# EAGLE design Schematic1 (EAGLE 7.4.0)
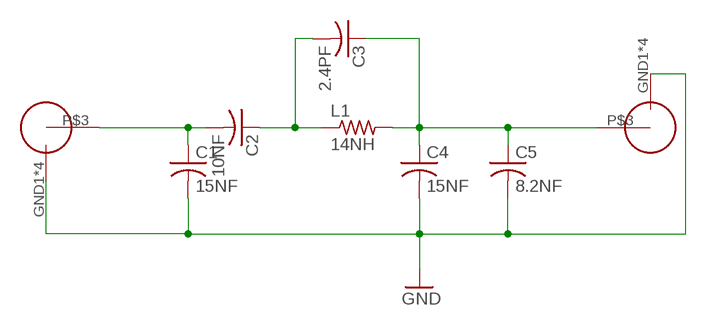
[diagram p0: schematic, sheet 1]

## Parts
C1  15NF  C-USC0603  [C0603]
C2  10NF  C-USC0603  [C0603]
C3  2.4PF  C-USC0603  [C0603]
C4  15NF  C-USC0603  [C0603]
C5  8.2NF  C-USC0603  [C0603]
GND  SMAJ716-ND  [SMAJ716-ND]
L1  14NH  R-US_R0603  [R0603]
U$2  SMAJ716-ND  [SMAJ716-ND]

## Nets
GND: C1.2 C4.2 C5.2 GND.GND1(OUTERCONDUCTOR) GND.GND2(OUTERCONDUCTOR) GND.GND3(OUTERCONDUCTOR) GND.GND4(OUTERCONDUCTOR) U$2.GND1(OUTERCONDUCTOR) U$2.GND2(OUTERCONDUCTOR) U$2.GND3(OUTERCONDUCTOR) U$2.GND4(OUTERCONDUCTOR)
N$4: C3.1 C4.1 C5.1 L1.2 U$2.P$3(CENTERCONDUCTOR)
N$6: C2.1 C3.2 L1.1
N$7: C1.1 C2.2 GND.P$3(CENTERCONDUCTOR)

## Library data of the parts
C1-C5 = adafruit:C-US: CAPACITOR, American symbol
GND U$2 = SMAJ16-ND:SMAJ716-ND
L1 = adafruit:R-US_: RESISTOR, American symbol

## Net classes
0 default: width 2.997 mm, drill 0.508 mm, clearance 1.27 mm

## Board
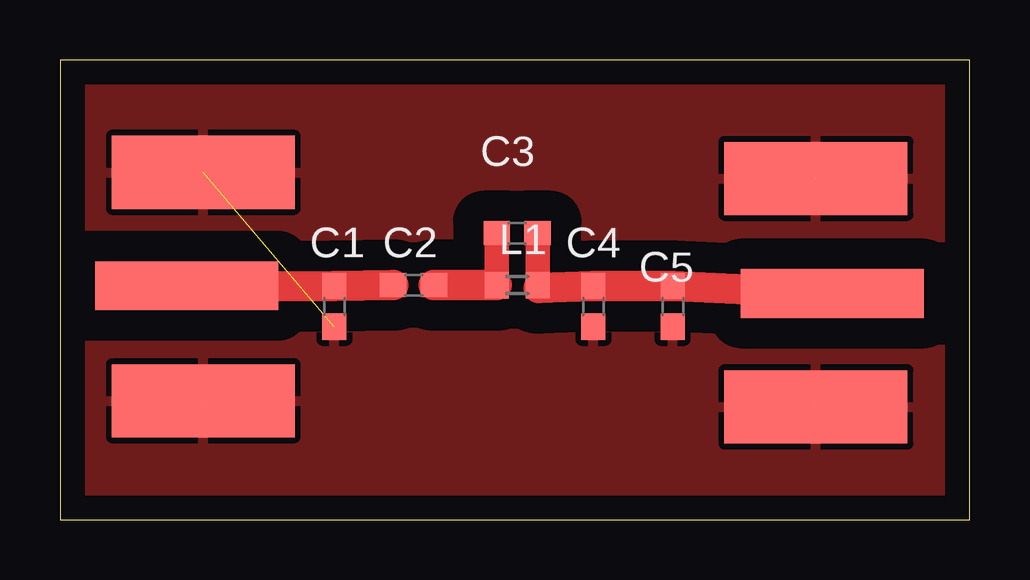
[diagram p1: board, top side]
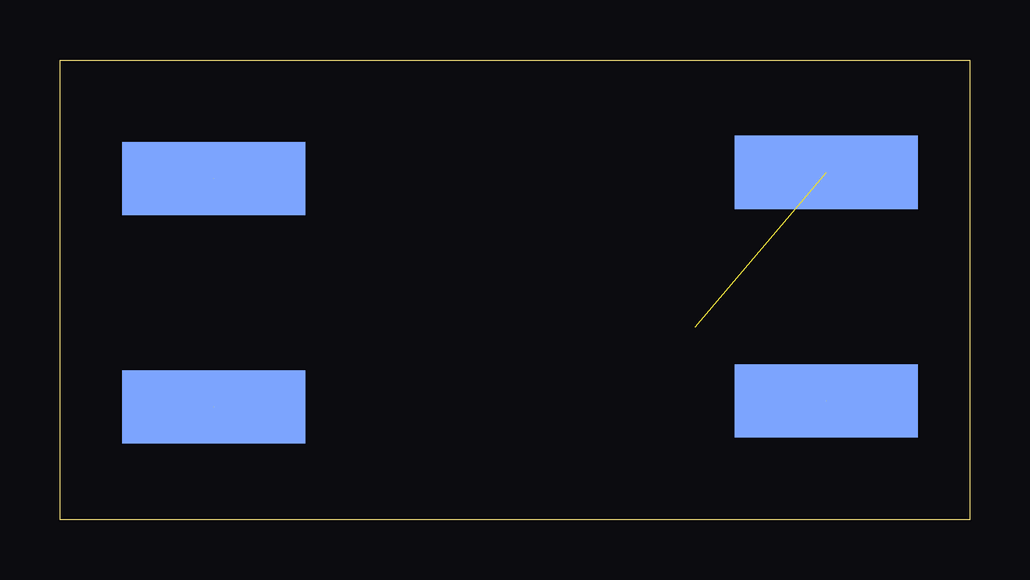
[diagram p2: board, bottom side, seen from below]

Size 37.9 x 19.17 mm. Coordinates in mm from the lower left corner, seen from the top.
Outline: 0,0 37.9,0 37.9,19.17 0,19.17 0,0
Copper layers (1*16): Top 0.035mm / dielectric 1.5mm / Bottom 0.035mm
Design rules "default": minimum track width 10mil, minimum drill 24mil, track to track 8mil, track to pad 8mil, pad to pad 8mil, via to via 8mil, smd to smd 8mil, copper to edge 40mil, drill to drill 8mil, minimum pad ring 10mil, minimum via ring 8mil, stop-mask expansion 4mil, vias tented up to drill 0mil, thermal gap 10mil

### Footprints (pad centres in the part's own frame; a part is rotated, then mirrored left to right if it is on the bottom)
C0603 = smd 1.1 x 1: 1 -0.85,0; 2 0.85,0
SMAJ716-ND = smd 3.048 x 7.62: GND1 4.826,0.508; GND2 -4.699,0.508 | smd 3.048 x 7.62 bottom: GND3 -4.699,0.508; GND4 4.826,0.508 | smd 2.032 x 7.62: P$3 0.025,-0.178
R0603 = smd 1 x 1.1: 1 -0.85,0; 2 0.85,0

### Placement (x,y rotation side)
C1  11.43,8.89 270 top
C2  14.73,9.78 180 top
C3  19.05,11.94 180 top
C4  22.22,8.89 270 top
C5  25.53,8.89 270 top
GND  5.46,9.78 270 top
L1  19.05,9.78 0 top
U$2  32,9.4 90 top

### Tracks (layer width: path | path; a pad name or v marks a point on that pad's centre or on a via)
GND  (5 unrouted)
  pour Top: -0.13,19.43 -0.25,19.43 -0.25,-0.38 38.23,-0.38 38.23,19.43
N$4
  Top 0.406: L1.2 19.94,9.65
  Top 1.016: C3.1 L1.2
  Top 1.27: 19.94,9.65 C4.1 C5.1 U$2.P$3
N$6
  Top 1.016: L1.1 C3.2
  Top 1.27: C2.1 L1.1
N$7
  Top 0.254: 5.74,9.73 GND.P$3
  Top 1.27: 5.74,9.73 C1.1 C2.2